# EAGLE design arduino_humidity_sensing (EAGLE 7.5.0)
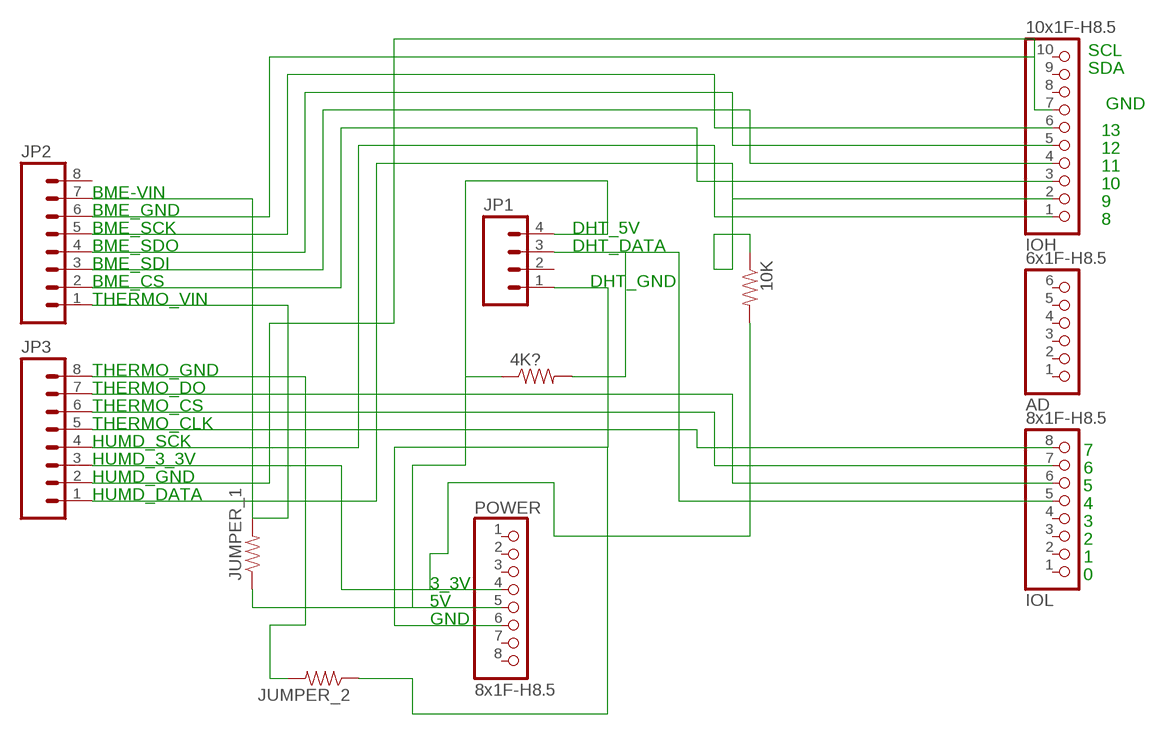
[diagram p0: schematic, sheet 1]

## Parts
4K?  RESISTORPTH-1/2W  [AXIAL-0.5]
10K  RESISTORKIT  [AXIAL-0.3-KIT]
AD  6x1F-H8.5  PINHD-1X6  [1X06]
IOH  10x1F-H8.5  PINHD-1X10_ARD  [1X10]
IOL  8x1F-H8.5  PINHD-1X8  [1X08]
JP1  M04PTH  [1X04]
JP2  M08NO_SILK  [1X08_NO_SILK]
JP3  M08NO_SILK  [1X08_NO_SILK]
JUMPER_1  RESISTORKIT  [AXIAL-0.3-KIT]
JUMPER_2  RESISTORKIT  [AXIAL-0.3-KIT]
POWER  8x1F-H8.5  PINHD-1X8  [1X08]

## Nets
N$1: 4K?.P$2 IOL.5 JP1.3
N$2: 4K?.P$1 JP1.4 JUMPER_1.P$1 POWER.5
N$3: JP1.1 JUMPER_2.P$1 POWER.6
N$4: 10K.P$1 IOH.2 JP3.1
N$6: IOH.1 JP3.4
N$7: IOL.8 JP3.5
N$8: IOL.7 JP3.6
N$9: IOL.6 JP3.7
N$10: IOH.4 JP2.3
N$11: IOH.5 JP2.4
N$12: IOH.3 JP2.2
N$13: IOH.6 JP2.5
N$14: IOH.7 JP2.6 JP3.2
N$15: JP2.1 JP2.7 JUMPER_1.P$2
N$16: JP3.8 JUMPER_2.P$2
N$17: 10K.P$2 JP3.3 POWER.4
Unconnected: AD.1 AD.2 AD.3 AD.4 AD.5 AD.6 IOH.8 IOH.9 IOH.10 IOL.1 IOL.2 IOL.3 IOL.4 JP1.2 JP2.8 POWER.1 POWER.2 POWER.3 POWER.7 POWER.8

## Notes on the sheet
- SCL
- SDA
- GND
- 13
- 12
- 11
- 10
- BME-VIN
- 9
- BME_GND
- 8
- BME_SCK | DHT_5V
- BME_SDO | DHT_DATA
- BME_SDI
- BME_CS | DHT_GND
- THERMO_VIN
- THERMO_GND
- THERMO_DO
- THERMO_CS
- THERMO_CLK
- HUMD_SCK
- 7
- HUMD_3_3V
- 6
- HUMD_GND
- 5
- HUMD_DATA
- 4
- 3
- 2
- 1
- 0
- 3_3V
- 5V
- GND

## Library data of the parts
4K? 10K JUMPER_1 JUMPER_2 = SparkFun-Resistors:RESISTOR: Resistor Basic schematic elements and footprints for 0603, 1206, and PTH resistors.
AD = SmartPrj:PINHD-1X6: PIN HEADER
IOH = SmartPrj:PINHD-1X10_ARD: PIN HEADER
IOL POWER = SmartPrj:PINHD-1X8: PIN HEADER
JP1 = SparkFun-Connectors:M04: Header 4 Standard 4-pin 0.1" header. Use with straight break away headers (SKU : PRT-00116), right angle break away headers (PRT-00553), swiss pins (PRT-00743), machine pins (PRT-00117), and female headers (PRT-00115). Molex polarized connector foot print use with SKU : PRT-08231 with associated crimp pins and housings. 1MM SMD Version SKU: PRT-10208
JP2 JP3 = SparkFun-Connectors:M08: Header 8 Standard 8-pin 0.1" header. Use with straight break away headers (SKU : PRT-00116), right angle break away headers (PRT-00553), swiss pins (PRT-00743), machine pins (PRT-00117), and female headers (PRT-00115).

## Net classes
0 default: width 0.254 mm, clearance 0.254 mm
1 power: width 0.61 mm, drill 0.61 mm, clearance 0.254 mm
2 gnd: width 0.305 mm, drill 0.559 mm, clearance 0.254 mm
3 usbvcc: width 0.508 mm, drill 0.61 mm, clearance 0.254 mm
4 aref: width 0.406 mm, drill 0.61 mm, clearance 0.254 mm

## Board
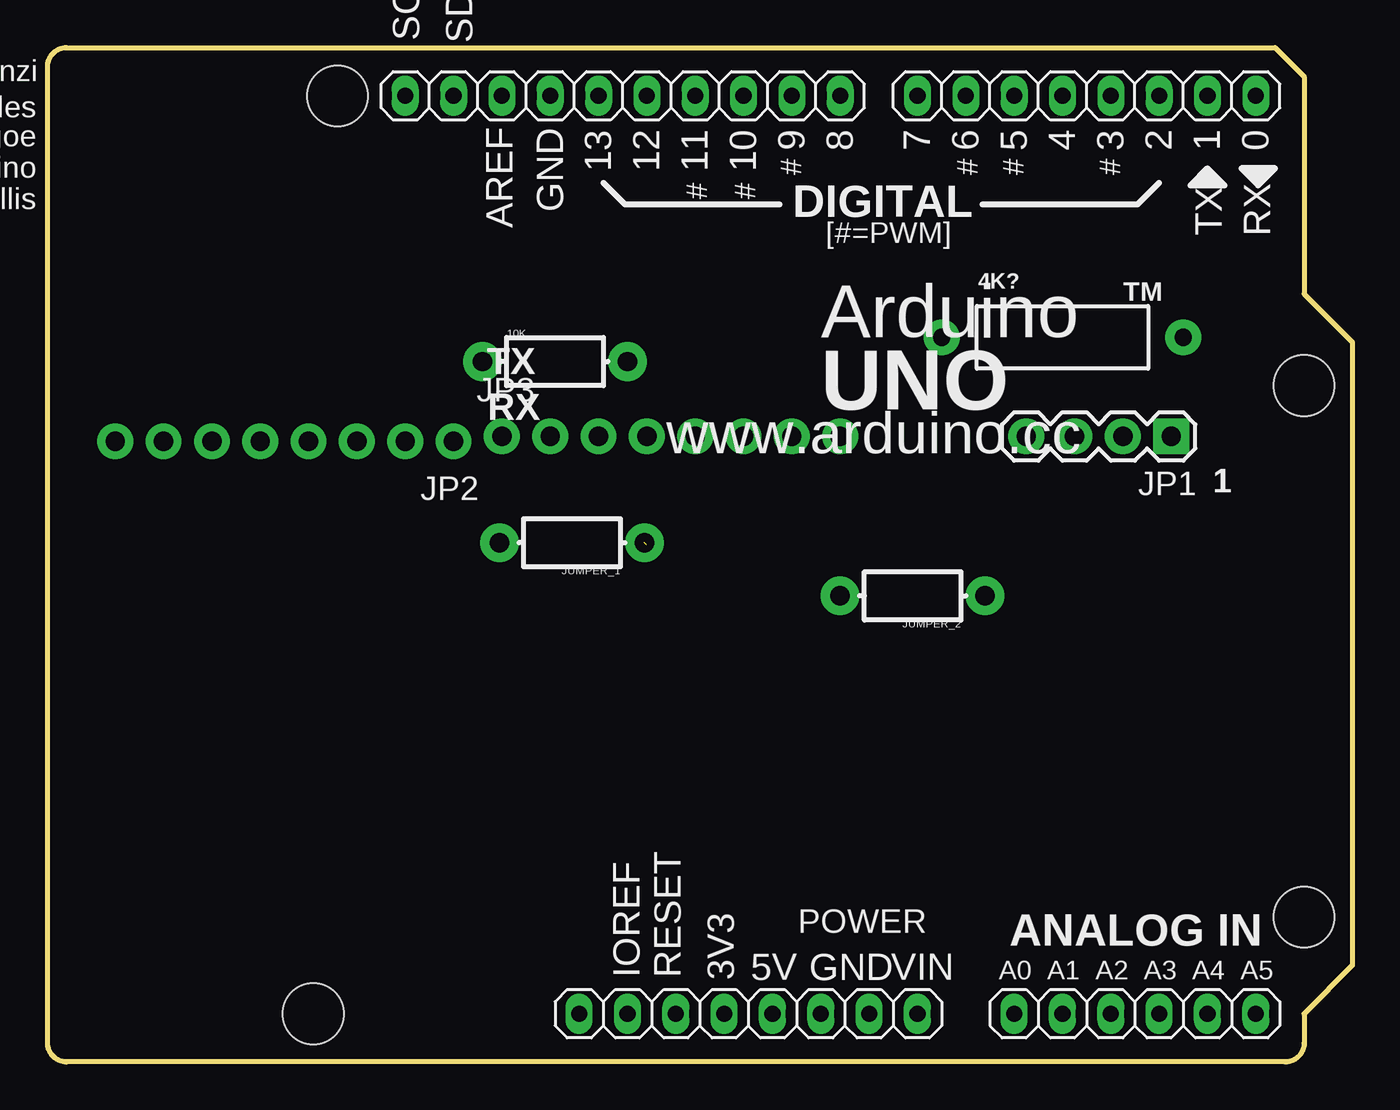
[diagram p1: board, top side]
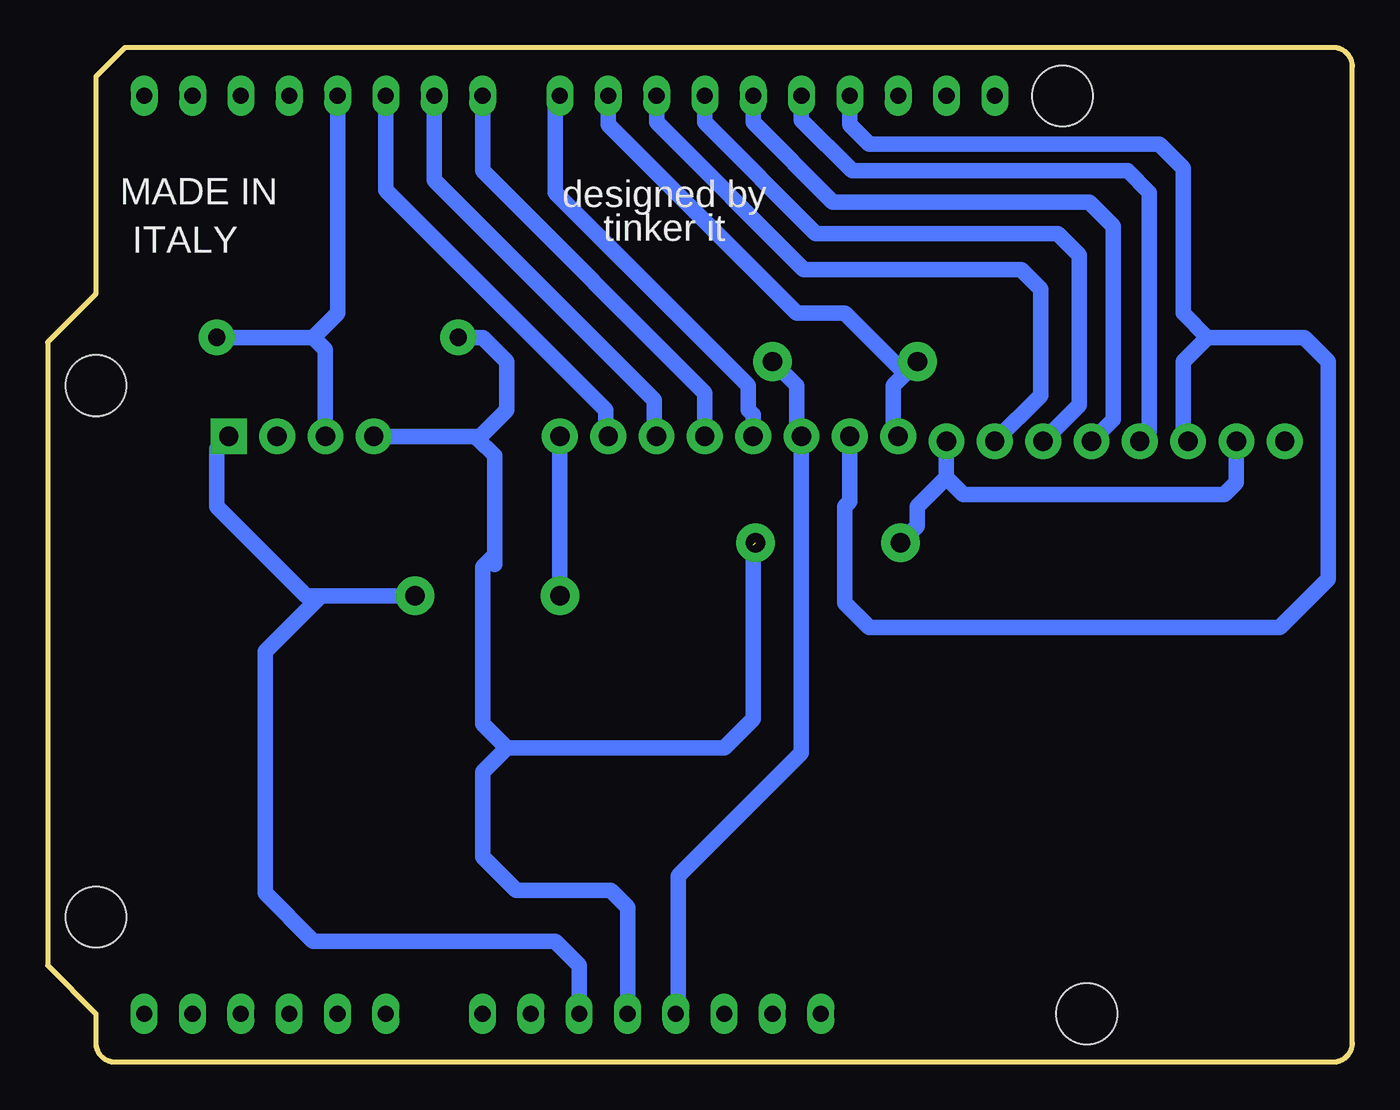
[diagram p2: board, bottom side, seen from below]

Size 68.58 x 53.34 mm. Coordinates in mm from the lower left corner, seen from the top.
Outline: 64.52,53.34 66.04,51.82 66.04,40.39 68.58,37.85 68.58,5.08 66.04,2.54 66.04,1 arc-90 65.04,0 1,0 arc-90 0,1 0,52.34 arc-90 1,53.34 64.52,53.34
Copper layers (1*16): Top 0.035mm / dielectric 1.5mm / Bottom 0.035mm
Design rules "default": minimum track width 10mil, minimum drill 22mil, track to track 10mil, track to pad 10mil, pad to pad 10mil, via to via 12mil, smd to smd 8mil, copper to edge 26mil, drill to drill 12mil, minimum pad ring 10mil, minimum via ring 10mil, stop-mask expansion 1mil, vias tented up to drill 30mil, thermal gap 10mil
Holes 3.2 mm at 66.04,35.56 66.04,7.62 15.24,50.8 13.97,2.54
vRestrict: area 22.9,44.1 to 24.6,49.1; area 25.4,45.5 to 27.1,49.1; area 28.4,45.3 to 29.6,48.8; area 31,45.3 to 32.1,48.8; area 33.5,45.3 to 34.7,48.8; area 36.1,45.3 to 37.2,48.8; area 38.7,47.2 to 39.9,48.8; area 40.3,45.1 to 47.6,46.9; area 60.3,44.2 to 61.7,46.7; area 62.9,44.2 to 64.3,46.7; area 61.3,35.8 to 64.8,37.2; area 0.6,21.8 to 2,30.1; 14 more areas

### Footprints (pad centres in the part's own frame; a part is rotated, then mirrored left to right if it is on the bottom)
AXIAL-0.5 = drill 0.9 pad 1.88: P$1 -6.35,0; P$2 6.35,0
AXIAL-0.3-KIT = drill 1.016 pad 2.032: P$1 -3.81,0; P$2 3.81,0
1X06 = drill 0.85 pad 1.422 long: 1 -6.35,0; 2 -3.81,0; 3 -1.27,0; 4 1.27,0; 5 3.81,0; 6 6.35,0
1X10 = drill 0.85 pad 1.422 long: 1 -11.43,0; 2 -8.89,0; 3 -6.35,0; 4 -3.81,0; 5 -1.27,0; 6 1.27,0; 7 3.81,0; 8 6.35,0; 9 8.89,0; 10 11.43,0
1X08 = drill 0.85 pad 1.422 long: 1 -8.89,0; 2 -6.35,0; 3 -3.81,0; 4 -1.27,0; 5 1.27,0; 6 3.81,0; 7 6.35,0; 8 8.89,0
1X04 = drill 1.016 pad 1.88 square: 1 0,0 | drill 1.016 pad 1.88: 2 2.54,0; 3 5.08,0; 4 7.62,0
1X08_NO_SILK = drill 1.016 pad 1.88: 1 0,0; 2 2.54,0; 3 5.08,0; 4 7.62,0; 5 10.16,0; 6 12.7,0; 7 15.24,0; 8 17.78,0

### Placement (x,y rotation side)
4K?  53.34,38.1 0 top
10K  26.67,36.83 0 top
AD  57.15,2.54 0 top
IOH  30.23,50.8 180 top
IOL  54.61,50.8 180 top
JP1  59.05,32.89 180 top
JP2  21.34,32.64 180 top
JP3  23.88,32.89 0 top
JUMPER_1  27.56,27.3 180 top
JUMPER_2  45.47,24.51 180 top
POWER  36.83,2.54 0 top

### Tracks (layer width: path | path; a pad name or v marks a point on that pad's centre or on a via)
N$1
  Bottom 0.813: IOL.5 53.34,39.37 54.61,38.1 | 54.61,38.1 4K?.P$2 | JP1.3 53.98,37.47 54.61,38.1
N$2  (1 unrouted)
  Bottom 0.813: POWER.5 38.1,8.13 38.99,9.02 43.94,9.02 45.72,10.79 45.72,15.24 44.45,16.51 | 45.09,26.16 45.09,26.67 | 45.09,26.67 45.09,31.88 45.97,32.77 | 45.97,32.77 46.1,32.89 JP1.4 | 31.5,27.18 31.5,18.03 33.02,16.51 44.45,16.51 | 44.45,16.51 45.72,17.78 45.72,26.04 45.09,26.67 | 4K?.P$1 45.72,38.1 44.45,36.83 44.45,34.29 45.97,32.77
N$3
  Bottom 0.813: JP1.1 59.69,32.26 59.69,29.21 54.99,24.51 JUMPER_2.P$1 54.23,24.51 57.15,21.59 57.15,8.89 54.61,6.35 41.91,6.35 40.64,5.08 POWER.6
N$4
  Bottom 0.813: 10K.P$1 23.5,36.2 | 23.5,36.2 24.13,35.56 24.13,33.15 JP3.1 24,32.89 24.13,33.02 | IOH.2 39.12,49.28 29.21,39.37 26.67,39.37 23.5,36.2
N$6
  Bottom 0.813: JP3.4 31.5,34.04 31.75,34.29 31.75,35.56 41.91,45.72 41.91,50.55 IOH.1
N$7
  Bottom 0.813: JP3.5 34.04,35.18 45.72,46.86 IOL.8
N$8
  Bottom 0.813: JP3.6 36.7,33.02 36.7,34.8 48.26,46.35 IOL.7
N$9
  Bottom 0.813: JP3.7 39.24,33.02 39.24,34.29 50.8,45.85 IOL.6
N$10
  Bottom 0.813: JP2.3 14.35,34.54 14.35,42.42 15.49,43.56 28.19,43.56 34.04,49.4 IOH.4
N$11
  Bottom 0.813: JP2.4 12.57,33.78 12.57,43.94 13.84,45.21 27.3,45.21 31.5,49.4 IOH.5
N$12
  Bottom 0.813: JP2.2 16.38,35.05 16.38,40.64 17.4,41.66 28.83,41.66 36.58,49.4 IOH.3
N$13
  Bottom 0.813: JP2.5 10.67,33.15 10.67,45.72 11.81,46.86 26.29,46.86 28.96,49.53 IOH.6
N$14
  Bottom 0.813: JP3.2 26.42,29.46 26.67,29.21 26.67,24.13 25.4,22.86 3.81,22.86 1.27,25.4 1.27,36.83 2.54,38.1 7.62,38.1 | IOH.7 26.42,49.28 25.4,48.26 10.16,48.26 8.89,46.99 8.89,39.37 7.62,38.1 | 7.62,38.1 8.89,36.83 8.89,32.89 JP2.6
N$15
  Bottom 0.813: JP2.1 21.34,30.73 | 21.34,30.73 20.45,29.84 6.73,29.84 6.1,30.48 JP2.7 | 21.34,30.73 22.86,29.21 22.86,28.19 JUMPER_1.P$2
N$16
  Bottom 0.813: JP3.8 JUMPER_2.P$2
N$17
  Bottom 0.813: POWER.4 35.43,2.67 35.43,9.78 28.96,16.26 JP3.3 29.21,33.15 29.21,35.56 10K.P$2

### Text on the board
tPlace: 13 | 12 | 11 | 10 | 9 | 8 | 7 | 6 | 5 | 4 | 3 | 2 | 1 | 0
tNames: SCL | SDA | M.Banzi | D.Cuartielles | T.Igoe | AREF | GND | G.Martino | # | # | # | # | D.Mellis | # | # | DIGITAL | [#=PWM] | TX | RX | TM | TX | Arduino | RX | UNO | www.arduino.cc | 1 | ANALOG IN | IOREF | RESET | 3V3 | 5V | GND | VIN | A0 | A1 | A2 | A3 | A4 | A5
bNames: MADE IN | designed by | MADE IN | ITALY | tinker it | ITALY | designed by | tinker it | ATMEGA328
ReferenceLC: L | TX | ON | RX | PC1 | PC2
214bmp: D:/SmartProjects/Snc/a4_bn_logo2.bmp